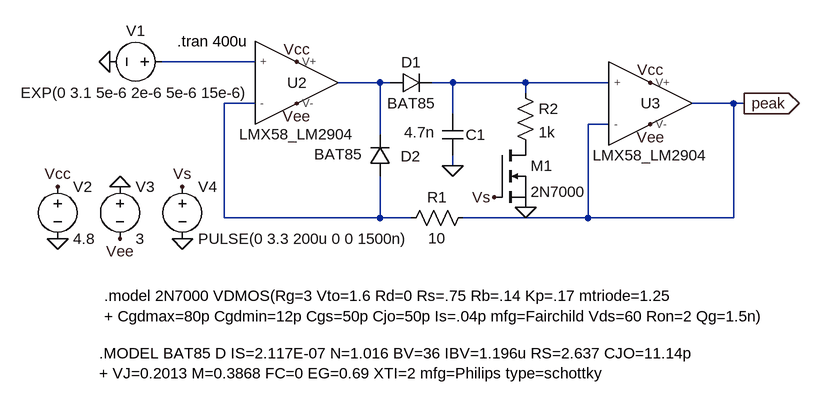
[diagram p0: schematic detectorLM358based.asc]
detectorLM358based.asc, the LTspice schematic file:
Version 4
SHEET 1 1700 680
WIRE 96 128 -48 128
WIRE 288 160 224 160
WIRE 304 160 288 160
WIRE 400 160 368 160
WIRE 512 160 400 160
WIRE 640 160 512 160
WIRE 512 176 512 160
WIRE 96 192 48 192
WIRE 832 192 768 192
WIRE 848 192 832 192
WIRE 400 208 400 160
WIRE 640 224 608 224
WIRE 288 240 288 160
WIRE 400 288 400 272
WIRE 48 368 48 192
WIRE 288 368 288 304
WIRE 288 368 48 368
WIRE 336 368 288 368
WIRE 608 368 608 224
WIRE 608 368 416 368
WIRE 832 368 832 192
WIRE 832 368 608 368
FLAG 400 288 0
FLAG -128 128 0
FLAG -112 320 0
FLAG -208 400 0
FLAG -208 320 Vcc
FLAG 160 128 Vcc
FLAG 704 160 Vcc
FLAG -112 400 Vee
FLAG 160 192 Vee
FLAG 704 224 Vee
FLAG 848 192 peak
IOPIN 848 192 Out
FLAG 512 352 0
FLAG -16 400 0
FLAG -16 320 Vs
FLAG 464 336 Vs
SYMBOL diode 304 176 R270
WINDOW 0 32 32 VTop 2
WINDOW 3 0 32 VBottom 2
SYMATTR InstName D1
SYMATTR Value BAT85
SYMBOL diode 304 304 R180
WINDOW 0 -47 31 Left 2
WINDOW 3 44 34 Left 2
SYMATTR InstName D2
SYMATTR Value BAT85
SYMBOL res 432 352 R90
WINDOW 0 0 56 VBottom 2
WINDOW 3 32 56 VTop 2
SYMATTR InstName R1
SYMATTR Value 10
SYMBOL cap 384 208 R0
WINDOW 0 36 32 Left 2
WINDOW 3 -59 28 Left 2
SYMATTR InstName C1
SYMATTR Value 4.7n
SYMATTR SpiceLine Rser=395.4m Lser=0 mfg="   ---" pn="   ---" type="   ---"
SYMBOL voltage -208 304 R0
WINDOW 123 0 0 Left 0
WINDOW 39 0 0 Left 0
SYMATTR InstName V2
SYMATTR Value 4.8
SYMBOL voltage -112 304 R0
WINDOW 123 0 0 Left 0
WINDOW 39 0 0 Left 0
SYMATTR InstName V3
SYMATTR Value 3
SYMBOL LMX58_LM2904 160 160 R0
SYMATTR InstName U2
SYMBOL LMX58_LM2904 704 192 R0
SYMATTR InstName U3
SYMBOL nmos 464 256 R0
SYMATTR InstName M1
SYMATTR Value 2N7000
SYMBOL Voltage -32 128 R90
WINDOW 0 -32 56 VBottom 2
WINDOW 3 32 56 VTop 2
SYMATTR InstName V1
SYMATTR Value EXP(0 3.1 5e-6 2e-6 5e-6 15e-6)
SYMBOL Res 496 160 R0
SYMATTR InstName R2
SYMATTR Value 1k
SYMBOL Voltage -16 304 R0
SYMATTR InstName V4
SYMATTR Value PULSE(0 3.3 200u 0 0 1500n)
TEXT -24 96 Left 2 !.tran 400u
TEXT -136 488 Left 2 !.model 2N7000 VDMOS(Rg=3 Vto=1.6 Rd=0 Rs=.75 Rb=.14 Kp=.17 mtriode=1.25 \n+ Cgdmax=80p Cgdmin=12p Cgs=50p Cjo=50p Is=.04p mfg=Fairchild Vds=60 Ron=2 Qg=1.5n)
TEXT -144 576 Left 2 !.MODEL BAT85 D IS=2.117E-07 N=1.016 BV=36 IBV=1.196u RS=2.637 CJO=11.14p \n+ VJ=0.2013 M=0.3868 FC=0 EG=0.69 XTI=2 mfg=Philips type=schottky

The netlist it stands for:
* detectorLM358based.asc
D1 N002 N003 BAT85
D2 N004 N002 BAT85
R1 peak N004 10
C1 N003 0 4.7n Rser=395.4m Lser=0 mfg="   ---" pn="   ---" type="   ---"
V2 Vcc 0 4.8
V3 0 Vee 3
XU2 N001 N004 Vcc Vee N002 LMX58_LM2904  ; pins + - V+ V- OUT
XU3 N003 peak Vcc Vee peak LMX58_LM2904  ; pins + - V+ V- OUT
M1 P001 Vs 0 0 2N7000
V1 N001 0 EXP(0 3.1 5e-6 2e-6 5e-6 15e-6)
R2 N003 P001 1k
V4 Vs 0 PULSE(0 3.3 200u 0 0 1500n)
.model D D
.lib standard.dio
.model NMOS NMOS
.model PMOS PMOS
.lib standard.mos
.tran 400u
.model 2N7000 VDMOS(Rg=3 Vto=1.6 Rd=0 Rs=.75 Rb=.14 Kp=.17 mtriode=1.25
+ Cgdmax=80p Cgdmin=12p Cgs=50p Cjo=50p Is=.04p mfg=Fairchild Vds=60 Ron=2 Qg=1.5n)
.MODEL BAT85 D IS=2.117E-07 N=1.016 BV=36 IBV=1.196u RS=2.637 CJO=11.14p
+ VJ=0.2013 M=0.3868 FC=0 EG=0.69 XTI=2 mfg=Philips type=schottky
.lib LMX58_LM2904.lib
.backanno
.end